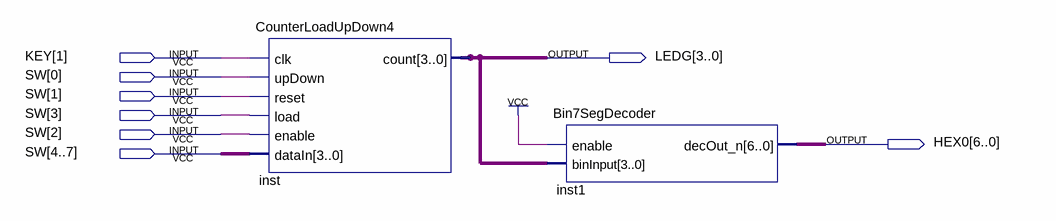
[diagram p0: schematic sheet]
// Quartus schematic Counter_Demo.bdf as structural Verilog: 2 symbols, 8 pins
module Counter_Demo (
  input  [1:1] KEY,
  input  [0:7] SW,
  output [3:0] LEDG,
  output [6:0] HEX0
);

  CounterLoadUpDown4 inst (
    .clk(KEY[1]), .upDown(SW[0]), .reset(SW[1]), .load(SW[3]), .enable(SW[2]), .dataIn(SW[4:7]), .count(LEDG));
  Bin7SegDecoder inst1 (.enable(1'b1), .binInput(LEDG), .decOut_n(HEX0));
endmodule
